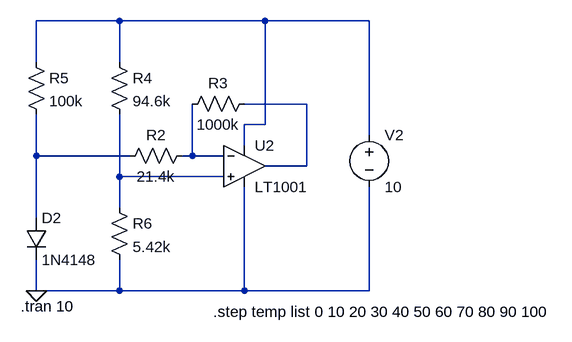
[diagram p0: schematic ProjectOfElectronics_Fazeli&Hamzeh.asc]
ProjectOfElectronics_Fazeli&Hamzeh.asc, the LTspice schematic file:
Version 4
SHEET 1 880 680
WIRE 16 -48 -112 -48
WIRE 240 -48 16 -48
WIRE 400 -48 240 -48
WIRE -112 16 -112 -48
WIRE 16 16 16 -48
WIRE 304 80 208 80
WIRE 240 112 240 -48
WIRE 240 112 208 112
WIRE 400 128 400 -48
WIRE 208 144 208 112
WIRE -112 160 -112 96
WIRE 32 160 -112 160
WIRE 128 160 128 80
WIRE 128 160 112 160
WIRE 176 160 128 160
WIRE 304 176 304 80
WIRE 304 176 240 176
WIRE 16 192 16 96
WIRE 176 192 16 192
WIRE 16 240 16 192
WIRE -112 256 -112 160
WIRE -112 368 -112 320
WIRE 16 368 16 320
WIRE 16 368 -112 368
WIRE 208 368 208 208
WIRE 208 368 16 368
WIRE 400 368 400 208
WIRE 400 368 208 368
FLAG -112 368 0
SYMBOL OpAmps\\LT1001 208 112 R0
SYMATTR InstName U2
SYMBOL res 128 144 R90
WINDOW 0 0 56 VBottom 2
WINDOW 3 32 56 VTop 2
SYMATTR InstName R2
SYMATTR Value 21.4k
SYMBOL res 224 64 R90
WINDOW 0 0 56 VBottom 2
WINDOW 3 32 56 VTop 2
SYMATTR InstName R3
SYMATTR Value 1000k
SYMBOL voltage 400 112 R0
WINDOW 123 0 0 Left 0
WINDOW 39 0 0 Left 0
SYMATTR InstName V2
SYMATTR Value 10
SYMBOL res 0 0 R0
SYMATTR InstName R4
SYMATTR Value 94.6k
SYMBOL res -128 0 R0
SYMATTR InstName R5
SYMATTR Value 100k
SYMBOL diode -128 256 R0
SYMATTR InstName D2
SYMATTR Value 1N4148
SYMBOL res 0 224 R0
SYMATTR InstName R6
SYMATTR Value 5.42k
TEXT -136 392 Left 2 !.tran 10
TEXT 160 400 Left 2 !.step temp list 0 10 20 30 40 50 60 70 80 90 100

The netlist it stands for:
* ProjectOfElectronics_Fazeli&Hamzeh.asc
XU2 N005 N004 N001 0 N002 LT1001  ; pins In+ In- V+ V- OUT
R2 N004 N003 21.4k
R3 N002 N004 1000k
V2 N001 0 10
R4 N001 N005 94.6k
R5 N001 N003 100k
D2 N003 0 1N4148
R6 N005 0 5.42k
.model D D
.lib standard.dio
.tran 10
.step temp list 0 10 20 30 40 50 60 70 80 90 100
.lib LTC.lib
.backanno
.end